# Altium project SmartIMU.PrjPCB
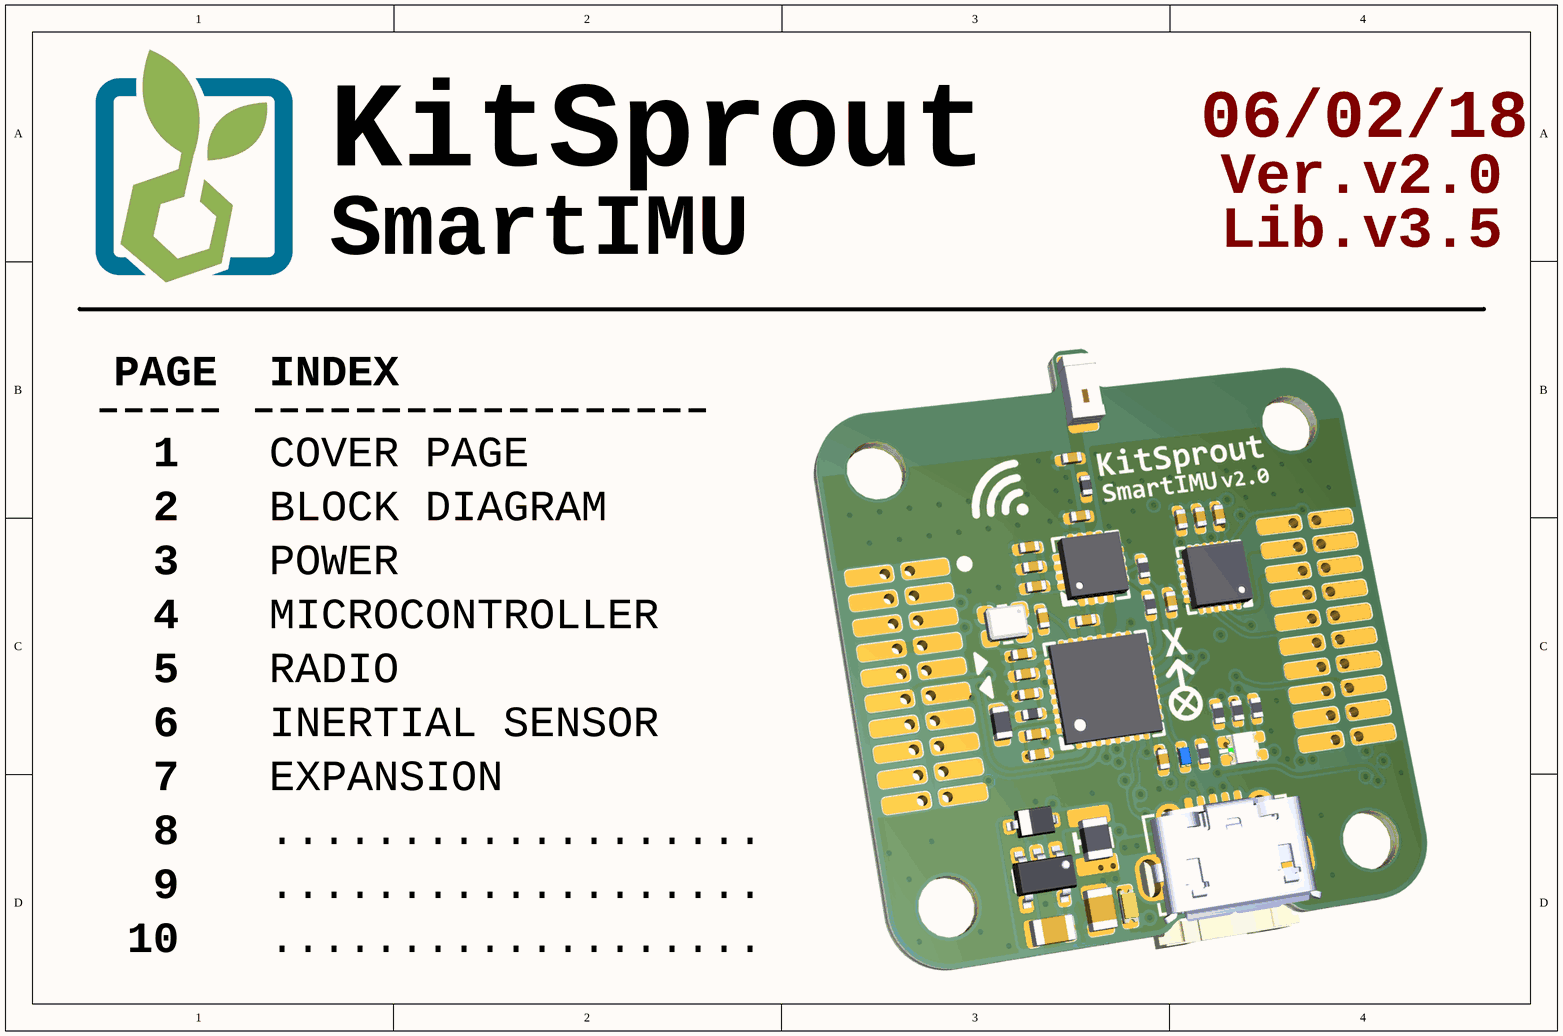
[diagram p0: [01] COVER PAGE.SchDoc]
7 sheets, 66 parts. Net scope: flat (ports and power ports of the same name join across sheets).
Board file: SmartIMU.PcbDoc
Sheets:
  [01] COVER PAGE.SchDoc
  [02] BLOCK DIAGRAM.SchDoc
    SENSOR = [06] INERTIAL SENSOR.SchDoc
    STM32 = [04] MICROCONTROLLER.SchDoc
    NRF52 = [05] RADIO.SchDoc
    LDO = [03] POWER.SchDoc
    EXPANSION = [07] EXPANSION.SchDoc

## Sheet [01] COVER PAGE.SchDoc: SmartIMU
size A4; Author: Hom; CompanyName: KitSprout; DrawnBy: Hom; Engineer: Hom; Organization: KitSprout; Revision: A; SheetNumber: 1; SheetTotal: 7; Version: v2.0; LibVersion: v3.5

### Notes on the sheet
- 06/02/18
- Ver.
- Lib.
- PAGE
- INDEX
- 1
- COVER PAGE
- 2
- 3
- BLOCK DIAGRAM
- POWER
- 4
- MICROCONTROLLER
- 5
- RADIO
- 6
- INERTIAL SENSOR
- 7
- 8
- EXPANSION
- ...................
- 9
- 10

## Sheet [02] BLOCK DIAGRAM.SchDoc: Template
size A4; Author: Hom; CompanyName: KitSprout; DrawnBy: Hom; Engineer: Hom; Organization: KitSprout; Revision: A; SheetNumber: 2; SheetTotal: 7; Version: 0.0; LibVersion: 0.0
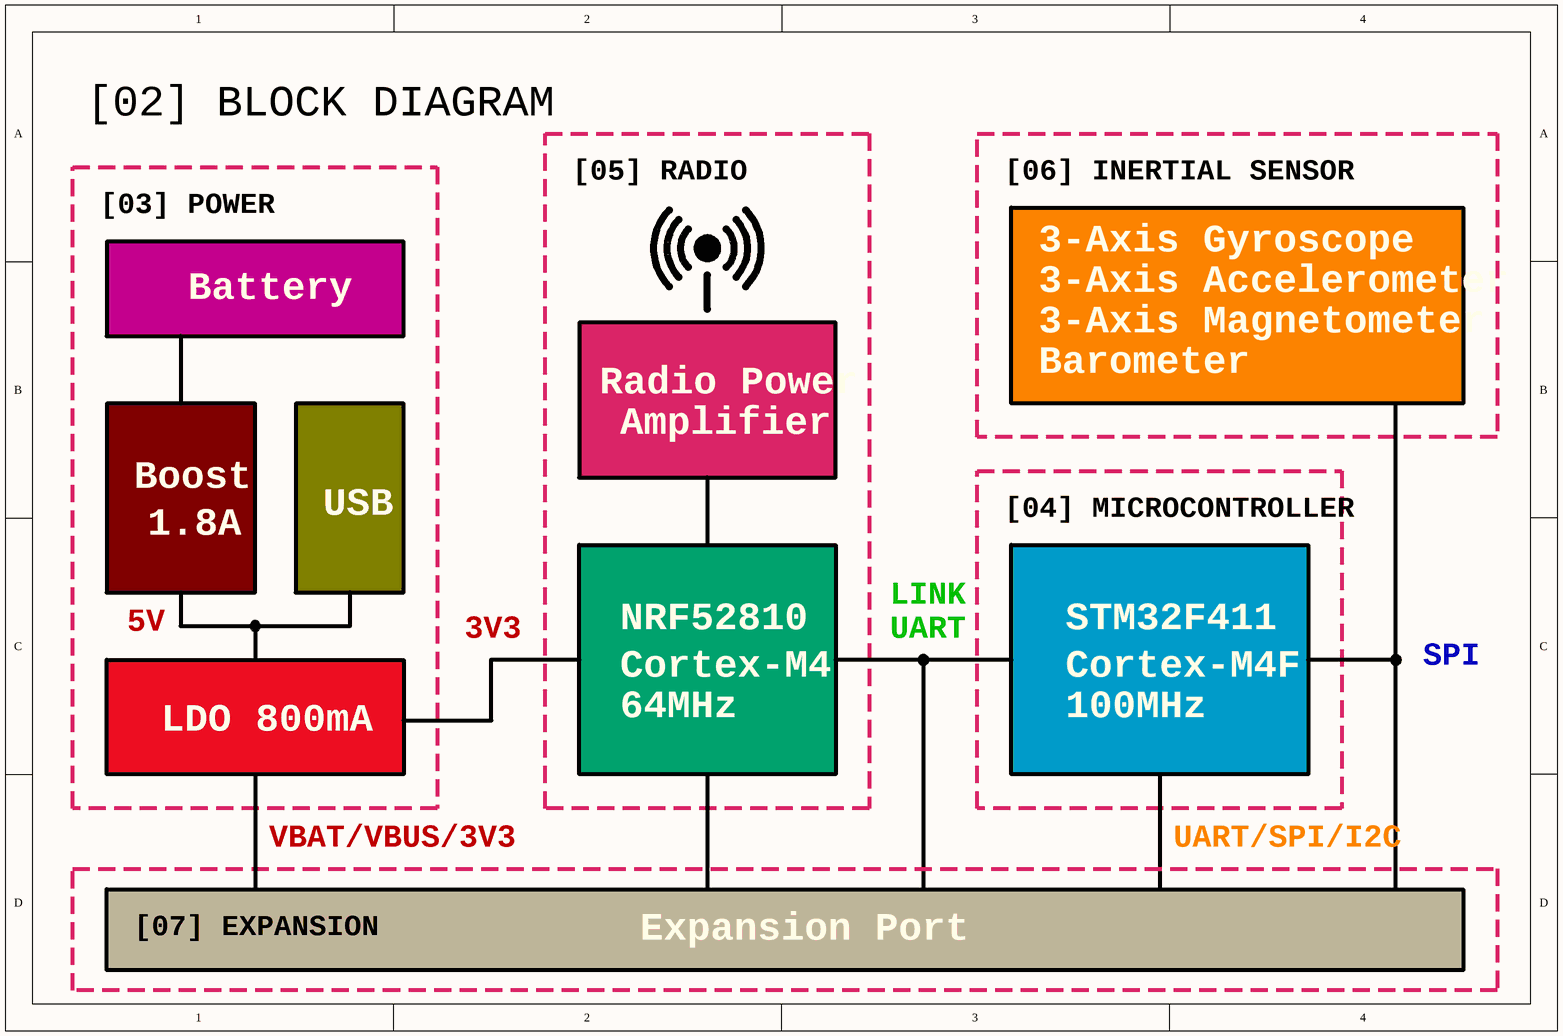
[diagram p1: [02] BLOCK DIAGRAM.SchDoc]

### Sub-sheets
EXPANSION = [07] EXPANSION.SchDoc: no entries
LDO = [03] POWER.SchDoc: no entries
NRF52 = [05] RADIO.SchDoc: no entries
SENSOR = [06] INERTIAL SENSOR.SchDoc: no entries
STM32 = [04] MICROCONTROLLER.SchDoc: no entries

### Notes on the sheet
- [02] BLOCK DIAGRAM
- [03] POWER
- [05] RADIO
- [06] INERTIAL SENSOR
- Battery
- 3-Axis Gyroscope
- 3-Axis Accelerometer
- Barometer
- 3-Axis Magnetometer
- Radio Power
- Amplifier
- Boost
- USB
- [04] MICROCONTROLLER
- 1.8A
- 5V
- 3V3
- NRF52810
- UART
- LINK
- STM32F411
- Cortex-M4
- Cortex-M4F
- SPI
- LDO
- 800mA
- 64MHz
- 100MHz
- VBAT/VBUS/3V3
- UART/SPI/I2C
- [07] EXPANSION
- Expansion Port

## Sheet [06] INERTIAL SENSOR.SchDoc: Template
size A4; Author: Hom; CompanyName: KitSprout; DrawnBy: Hom; Engineer: Hom; Organization: KitSprout; Revision: A; SheetNumber: 6; SheetTotal: 7; Version: 0.0; LibVersion: 0.0
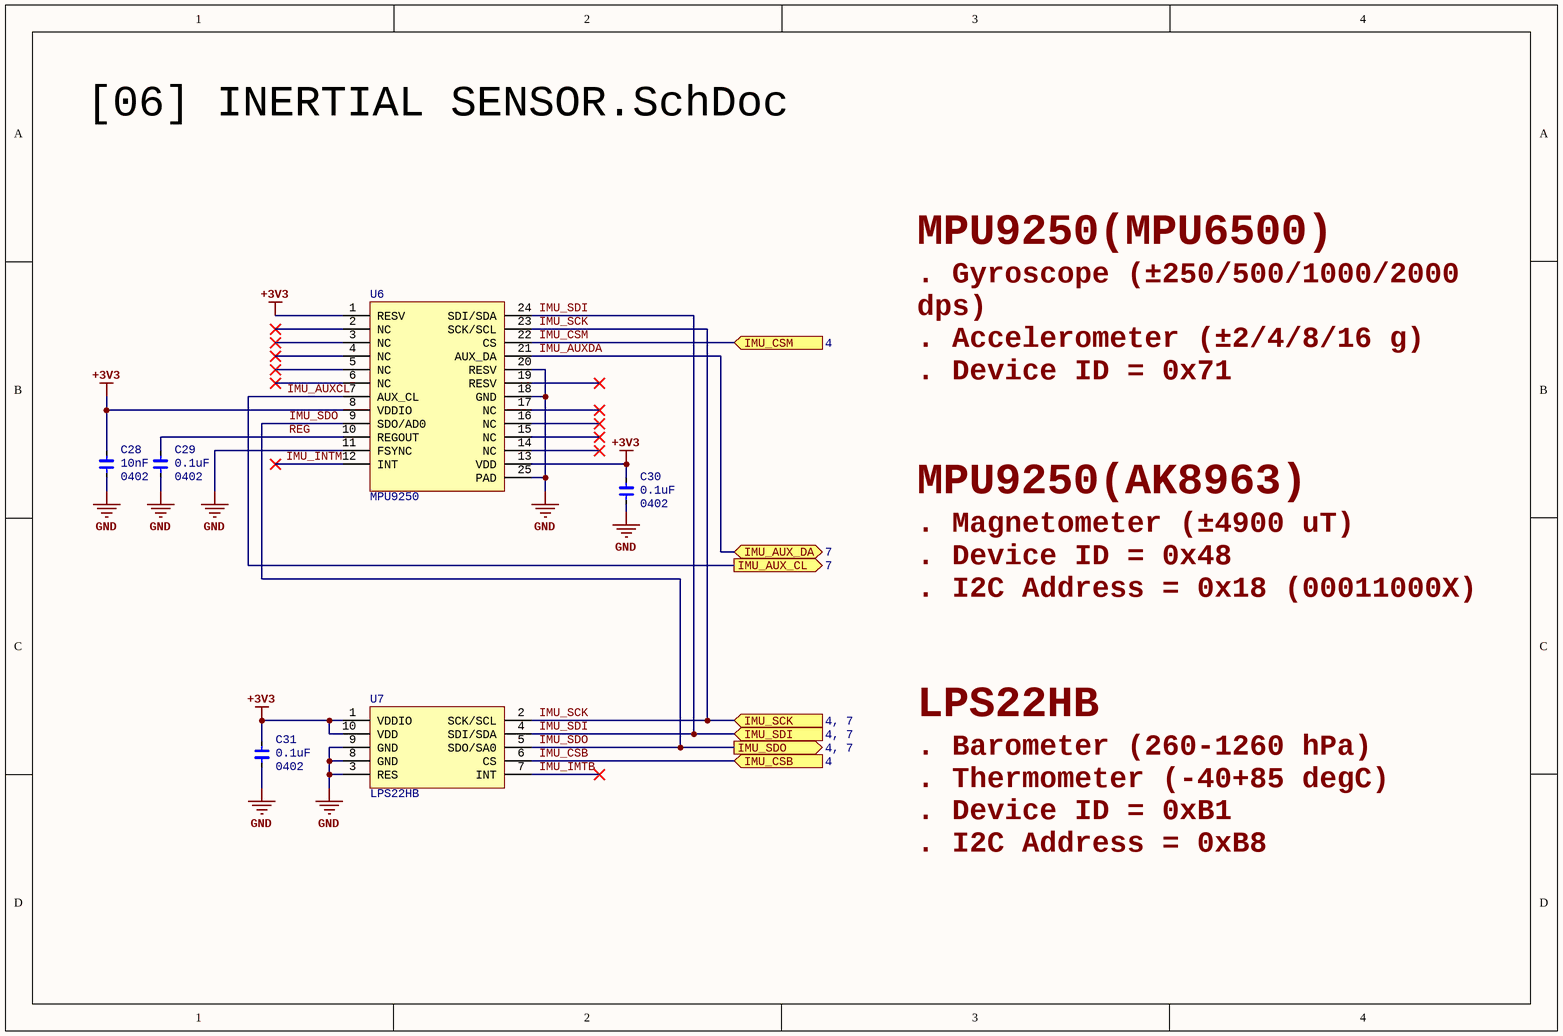
[diagram p2: [06] INERTIAL SENSOR.SchDoc]

### Parts
C28  value 10nF  Type: 0402  [CAP_0402]  (hidden comment: C0402)
C29  value 0.1uF  Type: 0402  [CAP_0402]  (hidden comment: C0402)
C30  value 0.1uF  Type: 0402  [CAP_0402]  (hidden comment: C0402)
C31  value 0.1uF  Type: 0402  [CAP_0402]  (hidden comment: C0402)
U6  MPU9250  [QFN_P0.4_24]
U7  LPS22HB  [HCLGA-2x2_10]

### Ports
IMU_AUX_CL (out, see 7), IMU_AUX_DA (bidir, see 7), IMU_CSB (in, see 4), IMU_CSM (in, see 4), IMU_SCK (in, see 4, 7), IMU_SDI (in, see 4, 7), IMU_SDO (out, see 4, 7)

### Nets
+3V3: C28.2 C30.2 C31.2 U6.1(RESV) U6.8(VDDIO) U6.13(VDD) U7.1(VDDIO) U7.10(VDD)
GND: C28.1 C29.1 C30.1 C31.1 U6.11(FSYNC) U6.18(GND) U6.20(RESV) U6.25(PAD) U7.3(RES) U7.8(GND) U7.9(GND)
IMU_AUXCL: U6.7(AUX_CL) ; port IMU_AUX_CL
IMU_AUXDA: U6.21(AUX_DA) ; port IMU_AUX_DA
IMU_CSB: U7.6(CS) ; port IMU_CSB
IMU_CSM: U6.22(CS) ; port IMU_CSM
IMU_IMTB: U7.7(INT)
IMU_INTM: U6.12(INT)
IMU_SCK: U6.23(SCK/SCL) U7.2(SCK/SCL) ; port IMU_SCK
IMU_SDI: U6.24(SDI/SDA) U7.4(SDI/SDA) ; port IMU_SDI
IMU_SDO: U6.9(SDO/AD0) U7.5(SDO/SA0) ; port IMU_SDO
REG: C29.2 U6.10(REGOUT)

Not connected (* = marked no-connect by the designer): U6 2(NC)* 3(NC)* 4(NC)* 5(NC)* 6(NC)* 14(NC)* 15(NC)* 16(NC)* 17(NC)* 19(RESV)*

### Notes on the sheet
- MPU9250(MPU6500)
- . Gyroscope (±250/500/1000/2000 dps)
  . Accelerometer (±2/4/8/16 g)
  . Device ID = 0x71
  . I2C Address = 0xD0 (1101000X)
- MPU9250(AK8963)
- . Magnetometer (±4900 uT)
  . Device ID = 0x48
  . I2C Address = 0x18 (00011000X)
- LPS22HB
- . Barometer (260-1260 hPa)
  . Thermometer (-40+85 degC)
  . Device ID = 0xB1
  . I2C Address = 0xB8

### Library data of the parts
C28-C31 = Cap_0402: Capacitor; Specification: X7R 50V; Manufacturer: *
U6 = MPU925x: Sensor Motion; Type: QFN24 P0.4
U7 = LPS22HB: Sensor Pressure; Type: LGA10 P0.5

## Sheet [04] MICROCONTROLLER.SchDoc: Template
size A4; Author: Hom; CompanyName: KitSprout; DrawnBy: Hom; Engineer: Hom; Organization: KitSprout; Revision: A; SheetNumber: 4; SheetTotal: 7; Version: 0.0; LibVersion: 0.0
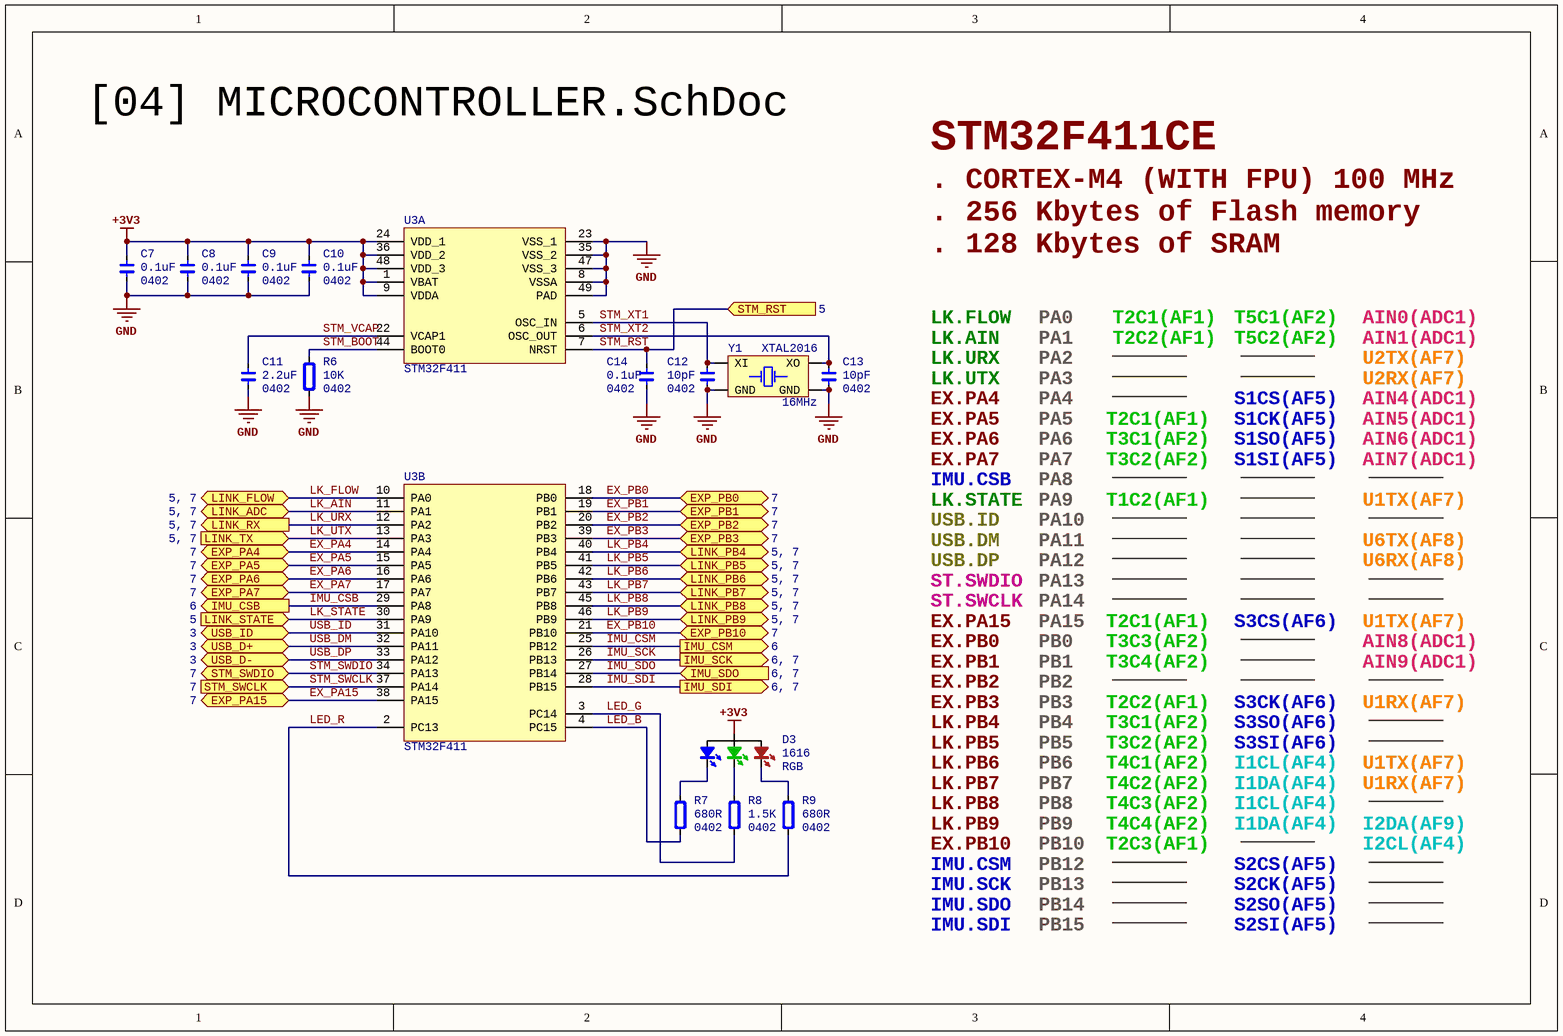
[diagram p3: [04] MICROCONTROLLER.SchDoc]

### Parts
C7  value 0.1uF  Type: 0402  [CAP_0402]  (hidden comment: C0402)
C8  value 0.1uF  Type: 0402  [CAP_0402]  (hidden comment: C0402)
C9  value 0.1uF  Type: 0402  [CAP_0402]  (hidden comment: C0402)
C10  value 0.1uF  Type: 0402  [CAP_0402]  (hidden comment: C0402)
C11  value 2.2uF  Type: 0402  [CAP_0402]  (hidden comment: C0402)
C12  value 10pF  Type: 0402  [CAP_0402]  (hidden comment: C0402)
C13  value 10pF  Type: 0402  [CAP_0402]  (hidden comment: C0402)
C14  value 0.1uF  Type: 0402  [CAP_0402]  (hidden comment: C0402)
D3  Type: 1616  [LED_1616_RGB]  (hidden comment: RGB)
R6  value 10K  Type: 0402  [RES_0402]  (hidden comment: R0402)
R7  value 680R  Type: 0402  [RES_0402]  (hidden comment: R0402)
R8  value 1.5K  Type: 0402  [RES_0402]  (hidden comment: R0402)
R9  value 680R  Type: 0402  [RES_0402]  (hidden comment: R0402)
U3  STM32F411  [QFN_P0.5_48]  (parts A,B of 2)
Y1  value 16MHz  [XT_2016_4]  (hidden comment: XTAL2016)

### Ports
EXP_PA4 (bidir, see 7), EXP_PA5 (bidir, see 7), EXP_PA6 (bidir, see 7), EXP_PA7 (bidir, see 7), EXP_PA15 (bidir, see 7), EXP_PB0 (bidir, see 7), EXP_PB1 (bidir, see 7), EXP_PB2 (bidir, see 7), EXP_PB3 (bidir, see 7), EXP_PB10 (bidir, see 7), IMU_CSB (out, see 6), IMU_CSM (out, see 6), IMU_SCK (out, see 6, 7), IMU_SDI (out, see 6, 7), IMU_SDO (in, see 6, 7), LINK_ADC (bidir, see 5, 7), LINK_FLOW (bidir, see 5, 7), LINK_PB4 (bidir, see 5, 7), LINK_PB5 (bidir, see 5, 7), LINK_PB6 (bidir, see 5, 7), LINK_PB7 (bidir, see 5, 7), LINK_PB8 (bidir, see 5, 7), LINK_PB9 (bidir, see 5, 7), LINK_RX (out, see 5, 7), LINK_STATE (in, see 5), LINK_TX (in, see 5, 7), STM_RST (in, see 5), STM_SWCLK (in, see 7), STM_SWDIO (bidir, see 7), USB_D+ (bidir, see 3), USB_D- (bidir, see 3), USB_ID (bidir, see 3)

### Nets
+3V3: C7.2 C8.2 C9.2 C10.2 D3.4(A) U3.1(VBAT) U3.9(VDDA) U3.24(VDD_1) U3.36(VDD_2) U3.48(VDD_3)
GND: C7.1 C8.1 C9.1 C10.1 C11.1 C12.1 C13.1 C14.1 R6.1 U3.8(VSSA) U3.23(VSS_1) U3.35(VSS_2) U3.47(VSS_3) U3.49(PAD) Y1.2(GND) Y1.4(GND)
EX_PA4: U3.14(PA4) ; port EXP_PA4
EX_PA5: U3.15(PA5) ; port EXP_PA5
EX_PA6: U3.16(PA6) ; port EXP_PA6
EX_PA7: U3.17(PA7) ; port EXP_PA7
EX_PA15: U3.38(PA15) ; port EXP_PA15
EX_PB0: U3.18(PB0) ; port EXP_PB0
EX_PB1: U3.19(PB1) ; port EXP_PB1
EX_PB2: U3.20(PB2) ; port EXP_PB2
EX_PB3: U3.39(PB3) ; port EXP_PB3
EX_PB10: U3.21(PB10) ; port EXP_PB10
IMU_CSB: U3.29(PA8) ; port IMU_CSB
IMU_CSM: U3.25(PB12) ; port IMU_CSM
IMU_SCK: U3.26(PB13) ; port IMU_SCK
IMU_SDI: U3.28(PB15) ; port IMU_SDI
IMU_SDO: U3.27(PB14) ; port IMU_SDO
LED_B: R7.1 U3.4(PC15)
LED_G: R8.1 U3.3(PC14)
LED_R: R9.1 U3.2(PC13)
LK_AIN: U3.11(PA1) ; port LINK_ADC
LK_FLOW: U3.10(PA0) ; port LINK_FLOW
LK_PB4: U3.40(PB4) ; port LINK_PB4
LK_PB5: U3.41(PB5) ; port LINK_PB5
LK_PB6: U3.42(PB6) ; port LINK_PB6
LK_PB7: U3.43(PB7) ; port LINK_PB7
LK_PB8: U3.45(PB8) ; port LINK_PB8
LK_PB9: U3.46(PB9) ; port LINK_PB9
LK_STATE: U3.30(PA9) ; port LINK_STATE
LK_URX: U3.12(PA2) ; port LINK_RX
LK_UTX: U3.13(PA3) ; port LINK_TX
STM_BOOT: R6.2 U3.44(BOOT0)
STM_RST: C14.2 U3.7(NRST) ; port STM_RST
STM_SWCLK: U3.37(PA14) ; port STM_SWCLK
STM_SWDIO: U3.34(PA13) ; port STM_SWDIO
STM_VCAP: C11.2 U3.22(VCAP1)
STM_XT1: C12.2 U3.5(OSC_IN) Y1.1(XI)
STM_XT2: C13.2 U3.6(OSC_OUT) Y1.3(XO)
USB_DM: U3.32(PA11) ; port USB_D+
USB_DP: U3.33(PA12) ; port USB_D-
USB_ID: U3.31(PA10) ; port USB_ID
NetD3_1: D3.1(R) R9.2
NetD3_2: D3.2(G) R8.2
NetD3_3: D3.3(B) R7.2

### Notes on the sheet
- STM32F411CE
- . CORTEX-M4 (WITH FPU) 100 MHz
  . 256 Kbytes of Flash memory
  . 128 Kbytes of SRAM
- LK.FLOW
- LK.AIN
- LK.URX
- LK.UTX
- PA0
- PA1
- PA2
- PA3
- T2C1(AF1)
- T2C2(AF1)
- T5C1(AF2)
- T5C2(AF2)
- AIN0(ADC1)
- AIN1(ADC1)
- U2TX(AF7)
- U2RX(AF7)
- EX.PA4
- EX.PA5
- EX.PA6
- PA4
- PA5
- PA6
- T3C1(AF2)
- S1CS(AF5)
- S1CK(AF5)
- S1SO(AF5)
- AIN4(ADC1)
- AIN5(ADC1)
- AIN6(ADC1)
- EX.PA7
- IMU.CSB
- LK.STATE
- PA7
- PA8
- PA9
- T3C2(AF2)
- T1C2(AF1)
- S1SI(AF5)
- AIN7(ADC1)
- U1TX(AF7)
- USB.ID
- USB.DM
- USB.DP
- PA10
- PA11
- PA12
- U6TX(AF8)
- U6RX(AF8)
- EX.PA15
- EX.PB0
- ST.SWDIO
- ST.SWCLK
- PA15
- PB0
- PA13
- PA14
- T3C3(AF2)
- S3CS(AF6)
- AIN8(ADC1)
- EX.PB1
- EX.PB3
- EX.PB2
- PB1
- PB3
- PB2
- T3C4(AF2)
- S3CK(AF6)
- AIN9(ADC1)
- U1RX(AF7)
- LK.PB4
- LK.PB5
- LK.PB6
- LK.PB7
- PB4
- PB5
- PB6
- PB7
- T4C1(AF2)
- T4C2(AF2)
- I1CL(AF4)
- I1DA(AF4)
- S3SO(AF6)
- S3SI(AF6)
- LK.PB8
- LK.PB9
- EX.PB10
- PB8
- PB9
- PB10
- T4C3(AF2)
- T4C4(AF2)
- T2C3(AF1)
- I2CL(AF4)
- I2DA(AF9)
- IMU.CSM
- IMU.SCK
- IMU.SDO
- PB12
- PB13
- PB14
- S2CS(AF5)
- S2CK(AF5)
- S2SO(AF5)
- IMU.SDI
- PB15
- S2SI(AF5)

### Library data of the parts
C7-C14 = Cap_0402: Capacitor; Specification: X7R 50V; Manufacturer: *
D3 = LED_1616_RGB: LED; Value: RGB
R6-R9 = Res_0402: Resistor; Specification: ±5%; Manufacturer: *
U3 = STM32F4x1C: MCU; Value: 100MHz; Type: QFN48 P0.5
Y1 = XTAL_2016_4P: Crystal Oscillator; Type: XTAL2016

## Sheet [05] RADIO.SchDoc: Template
size A4; Author: Hom; CompanyName: KitSprout; DrawnBy: Hom; Engineer: Hom; Organization: KitSprout; Revision: A; SheetNumber: 5; SheetTotal: 7; Version: 0.0; LibVersion: 0.0
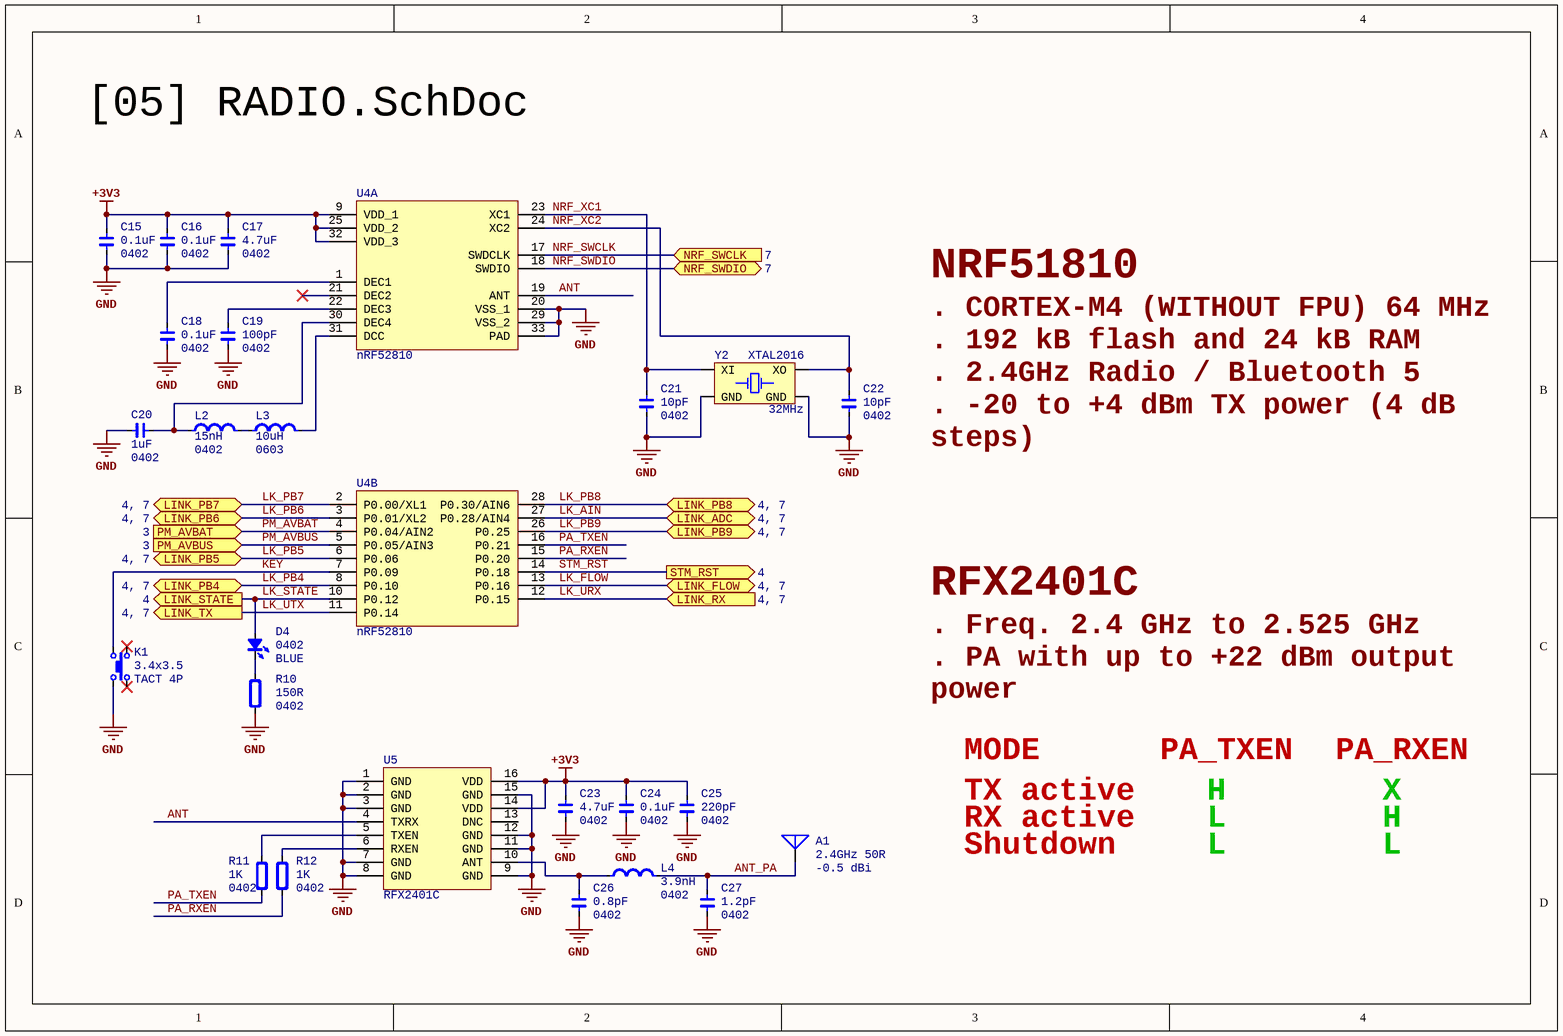
[diagram p4: [05] RADIO.SchDoc]

### Parts
A1  2.4GHz 50R  value -0.5 dBi  [ANT_2.4G_3.2x1.6]
C15  value 0.1uF  Type: 0402  [CAP_0402]  (hidden comment: C0402)
C16  value 0.1uF  Type: 0402  [CAP_0402]  (hidden comment: C0402)
C17  value 4.7uF  Type: 0402  [CAP_0402]  (hidden comment: C0402)
C18  value 0.1uF  Type: 0402  [CAP_0402]  (hidden comment: C0402)
C19  value 100pF  Type: 0402  [CAP_0402]  (hidden comment: C0402)
C20  value 1uF  Type: 0402  [CAP_0402]  (hidden comment: C0402)
C21  value 10pF  Type: 0402  [CAP_0402]  (hidden comment: C0402)
C22  value 10pF  Type: 0402  [CAP_0402]  (hidden comment: C0402)
C23  value 4.7uF  Type: 0402  [CAP_0402]  (hidden comment: C0402)
C24  value 0.1uF  Type: 0402  [CAP_0402]  (hidden comment: C0402)
C25  value 220pF  Type: 0402  [CAP_0402]  (hidden comment: C0402)
C26  value 0.8pF  Type: 0402  [CAP_0402]  (hidden comment: C0402)
C27  value 1.2pF  Type: 0402  [CAP_0402]  (hidden comment: C0402)
D4  Type: 0402  [LED_0402_BLUE]  (hidden comment: BLUE)
K1  value 3.4x3.5  [ButtonTACT_3.4*3.5_90]  (hidden comment: TACT 4P)
L2  value 15nH  Type: 0402  [IND_0402]  (hidden comment: H0402)
L3  value 10uH  Type: 0603  [IND_0603]  (hidden comment: H0603)
L4  value 3.9nH  Type: 0402  [IND_0402]  (hidden comment: H0402)
R10  value 150R  Type: 0402  [RES_0402]  (hidden comment: R0402)
R11  value 1K  Type: 0402  [RES_0402]  (hidden comment: R0402)
R12  value 1K  Type: 0402  [RES_0402]  (hidden comment: R0402)
U4  nRF52810  [QFN_P0.5_32]  (parts A,B of 2)
U5  RFX2401C  [QFN_P0.5_16]
Y2  value 32MHz  [XT_2016_4]  (hidden comment: XTAL2016)

### Ports
LINK_ADC (bidir, see 4, 7), LINK_FLOW (bidir, see 4, 7), LINK_PB4 (bidir, see 4, 7), LINK_PB5 (bidir, see 4, 7), LINK_PB6 (bidir, see 4, 7), LINK_PB7 (bidir, see 4, 7), LINK_PB8 (bidir, see 4, 7), LINK_PB9 (bidir, see 4, 7), LINK_RX (in, see 4, 7), LINK_STATE (out, see 4), LINK_TX (out, see 4, 7), NRF_SWCLK (in, see 7), NRF_SWDIO (bidir, see 7), PM_AVBAT (in, see 3), PM_AVBUS (in, see 3), STM_RST (out, see 4)

### Nets
+3V3: C15.2 C16.2 C17.2 C23.2 C24.2 C25.2 U4.9(VDD_1) U4.25(VDD_2) U4.32(VDD_3) U5.14(VDD) U5.16(VDD)
GND: C15.1 C16.1 C17.1 C18.1 C19.1 C20.2 C21.1 C22.1 C23.1 C24.1 C25.1 C26.1 C27.1 K1.1 R10.1 U4.20(VSS_1) U4.29(VSS_2) U4.33(PAD) U5.1(GND) U5.2(GND) U5.3(GND) U5.7(GND) U5.8(GND) U5.9(GND) U5.11(GND) U5.12(GND) U5.15(GND) Y2.2(GND) Y2.4(GND)
ANT: U4.19(ANT) U5.4(TXRX)
ANT_PA: A1.1(A) C27.2 L4.2
KEY: K1.2 U4.7(P0.09)
LK_AIN: U4.27(P0.28/AIN4) ; port LINK_ADC
LK_FLOW: U4.13(P0.16) ; port LINK_FLOW
LK_PB4: U4.8(P0.10) ; port LINK_PB4
LK_PB5: U4.6(P0.06) ; port LINK_PB5
LK_PB6: U4.3(P0.01/XL2) ; port LINK_PB6
LK_PB7: U4.2(P0.00/XL1) ; port LINK_PB7
LK_PB8: U4.28(P0.30/AIN6) ; port LINK_PB8
LK_PB9: U4.26(P0.25) ; port LINK_PB9
LK_STATE: D4.1(A) U4.10(P0.12) ; port LINK_STATE
LK_URX: U4.12(P0.15) ; port LINK_RX
LK_UTX: U4.11(P0.14) ; port LINK_TX
NRF_SWCLK: U4.17(SWDCLK) ; port NRF_SWCLK
NRF_SWDIO: U4.18(SWDIO) ; port NRF_SWDIO
NRF_XC1: C21.2 U4.23(XC1) Y2.1(XI)
NRF_XC2: C22.2 U4.24(XC2) Y2.3(XO)
PA_RXEN: R12.1 U4.15(P0.20)
PA_TXEN: R11.1 U4.16(P0.21)
PM_AVBAT: U4.4(P0.04/AIN2) ; port PM_AVBAT
PM_AVBUS: U4.5(P0.05/AIN3) ; port PM_AVBUS
STM_RST: U4.14(P0.18) ; port STM_RST
NetC18_2: C18.2 U4.1(DEC1)
NetC19_2: C19.2 U4.22(DEC3)
NetC20_1: C20.1 L2.1 U4.30(DEC4)
NetC26_2: C26.2 L4.1 U5.10(ANT)
NetD4_2: D4.2(K) R10.2
NetL2_2: L2.2 L3.1
NetL3_2: L3.2 U4.31(DCC)
NetR11_2: R11.2 U5.5(TXEN)
NetR12_2: R12.2 U5.6(RXEN)

Not connected (* = marked no-connect by the designer): K1 3* 4*; U4 21(DEC2)*; U5 13(DNC)

### Notes on the sheet
- NRF51810
- . CORTEX-M4 (WITHOUT FPU) 64 MHz
  . 192 kB flash and 24 kB RAM
  . 2.4GHz Radio / Bluetooth 5
  . -20 to +4 dBm TX power (4 dB steps)
  . -96 dBm sensitivity
- RFX2401C
- . Freq. 2.4 GHz to 2.525 GHz
  . PA with up to +22 dBm output power
  . LNA with 2.5 dB noise figure
- MODE
- PA_TXEN
- PA_RXEN
- TX active
- RX active
- H
- L
- X
- Shutdown

### Library data of the parts
A1 = Ant_2.4G: Antenna; type: 3.2x1.6
C15-C27 = Cap_0402: Capacitor; Specification: X7R 50V; Manufacturer: *
D4 = LED_0402: LED; Value: BLUE
K1 = ButtonTACT: Button; type: TACT 4P
L2 L4 = Ind_0402: Inductor; Specification: ±5% 100mA; Manufacturer: *
L3 = Ind_0603: Inductor; Specification: ±5% 100mA; Manufacturer: *
R10-R12 = Res_0402: Resistor; Specification: ±5%; Manufacturer: *
U4 = nRF52810: MCU; Value: 64MHz; Type: QFN32 P0.5
U5 = RFX2401C: Radio PA/LNA; Type: QFN16 P0.5
Y2 = XTAL_2016_4P: Crystal Oscillator; Type: XTAL2016

## Sheet [03] POWER.SchDoc: Template
size A4; Author: Hom; CompanyName: KitSprout; DrawnBy: Hom; Engineer: Hom; Organization: KitSprout; Revision: A; SheetNumber: 3; SheetTotal: 7; Version: 0.0; LibVersion: 0.0
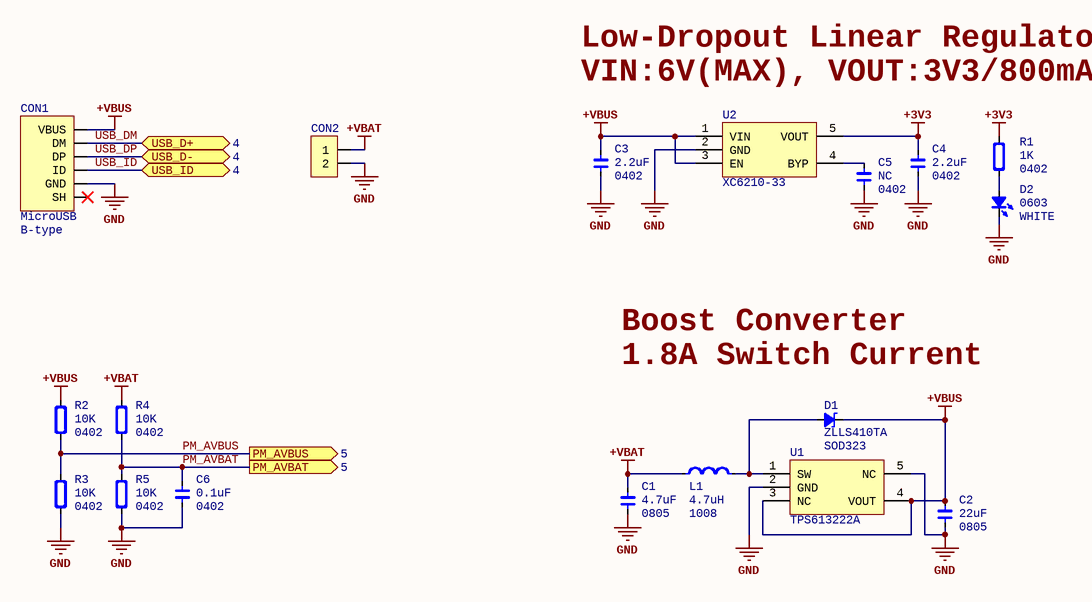
[diagram p5: [03] POWER.SchDoc]

### Parts
C1  value 4.7uF  Type: 0805  [CAP_0805]  (hidden comment: C0805)
C2  value 22uF  Type: 0805  [CAP_0805]  (hidden comment: C0805)
C3  value 2.2uF  Type: 0402  [CAP_0402]  (hidden comment: C0402)
C4  value 2.2uF  Type: 0402  [CAP_0402]  (hidden comment: C0402)
C5  value NC  Type: 0402  [CAP_0402]  (hidden comment: C0402)
C6  value 0.1uF  Type: 0402  [CAP_0402]  (hidden comment: C0402)
CON1  MicroUSB  Type: B-type  [USB_Micro-AB]
CON2  MX1.25_2P  [MX1.25_S90_2P]  (value not drawn)
D1  Type: SOD323  [SOD-323]  (hidden comment: ZLLS410TA)
D2  Type: 0603  [LED_0603_YELLOW]  (hidden comment: WHITE)
L1  value 4.7uH  Type: 1008  [IND_1008]  (hidden comment: H1008)
R1  value 1K  Type: 0402  [RES_0402]  (hidden comment: R0402)
R2  value 10K  Type: 0402  [RES_0402]  (hidden comment: R0402)
R3  value 10K  Type: 0402  [RES_0402]  (hidden comment: R0402)
R4  value 10K  Type: 0402  [RES_0402]  (hidden comment: R0402)
R5  value 10K  Type: 0402  [RES_0402]  (hidden comment: R0402)
U1  TPS613222A  [SOT23-5]
U2  XC6210-33  [SOT23-5]

### Ports
PM_AVBAT (out, see 5), PM_AVBUS (out, see 5), USB_D+ (bidir, see 4), USB_D- (bidir, see 4), USB_ID (bidir, see 4)

### Nets
+3V3: C4.2 R1.2 U2.5(VOUT)
+VBAT: C1.2 CON2.1 L1.1 R4.2
+VBUS: C2.2 C3.2 CON1.1(VBUS) D1.2(K) R2.2 U1.3(NC) U1.4(VOUT) U2.1(VIN) U2.3(EN)
GND: C1.1 C2.1 C3.1 C4.1 C5.1 C6.1 CON1.5(GND) CON2.2 D2.2(K) R3.1 R5.1 U1.2(GND) U1.5(NC) U2.2(GND)
PM_AVBAT: C6.2 R4.1 R5.2 ; port PM_AVBAT
PM_AVBUS: R2.1 R3.2 ; port PM_AVBUS
USB_DM: CON1.2(DM) ; port USB_D+
USB_DP: CON1.3(DP) ; port USB_D-
USB_ID: CON1.4(ID) ; port USB_ID
NetC5_2: C5.2 U2.4(BYP)
NetD1_1: D1.1(A) L1.2 U1.1(SW)
NetD2_1: D2.1(A) R1.1

Not connected (* = marked no-connect by the designer): CON1 0(SH)*

### Notes on the sheet
- Low-Dropout Linear Regulator
- VIN:6V(MAX), VOUT:3V3/800mA
- Boost Converter
- (near D1) 1.8A Switch Current

### Library data of the parts
C1 C2 = Cap_0805: Capacitor; Specification: X7R 50V; Manufacturer: *
C3-C6 = Cap_0402: Capacitor; Specification: X7R 50V; Manufacturer: *
CON1 = USB_Micro: USB
CON2 = MX1.25_2P: MX
D1 = SchottkyDiode_SOD323: Schottky Diode; Value: ZLLS410TA
D2 = LED_0603: LED; Value: WHITE
L1 = Ind_1008: Inductor; Specification: ±5% 100mA; Manufacturer: *
R1-R5 = Res_0402: Resistor; Specification: ±5%; Manufacturer: *
U1 = TPS61322xx: Power; Value: 5V; Type: SOT23-5
U2 = RT9193: Power; Value: 3V3; Type: SOT23-5

## Sheet [07] EXPANSION.SchDoc: Template
size A4; Author: Hom; CompanyName: KitSprout; DrawnBy: Hom; Engineer: Hom; Organization: KitSprout; Revision: A; SheetNumber: 7; SheetTotal: 7; Version: 0.0; LibVersion: 0.0
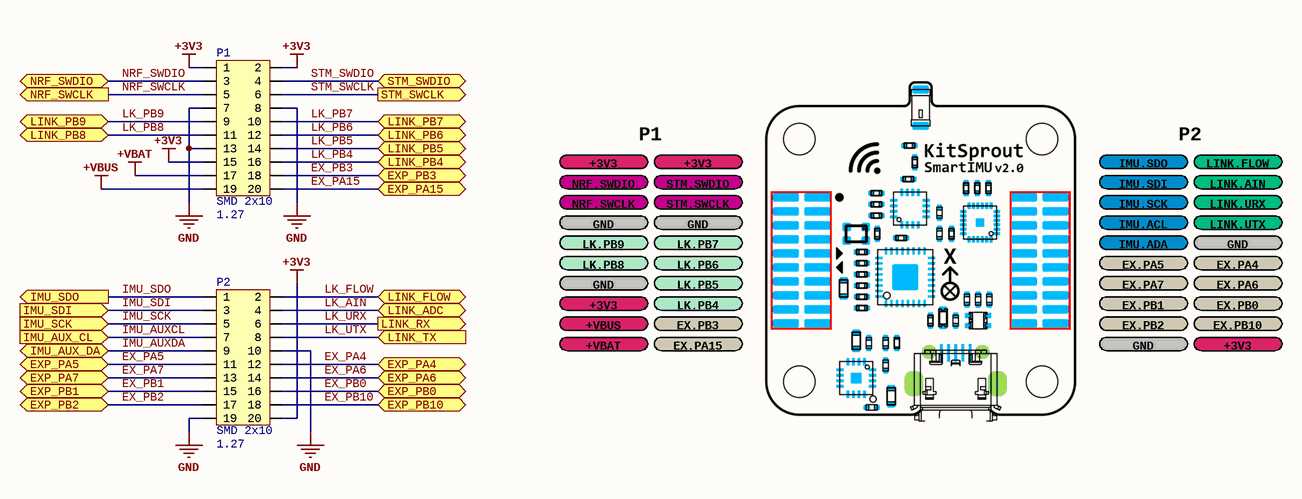
[diagram p6: [07] EXPANSION.SchDoc]

### Parts
P1  Type: SMD 2x10  [HDR2X10_1.27_180TBH]  (hidden comment: 1.27)
P2  Type: SMD 2x10  [HDR2X10_1.27_180TBH]  (hidden comment: 1.27)

### Ports
EXP_PA4 (bidir), EXP_PA5 (bidir), EXP_PA6 (bidir), EXP_PA7 (bidir), EXP_PA15 (bidir), EXP_PB0 (bidir), EXP_PB1 (bidir), EXP_PB2 (bidir), EXP_PB3 (bidir), EXP_PB10 (bidir), IMU_AUX_CL (in), IMU_AUX_DA (bidir), IMU_SCK (in), IMU_SDI (in), IMU_SDO (out), LINK_ADC (bidir), LINK_FLOW (bidir), LINK_PB4 (bidir), LINK_PB5 (bidir), LINK_PB6 (bidir), LINK_PB7 (bidir), LINK_PB8 (bidir), LINK_PB9 (bidir), LINK_RX (out), LINK_TX (in), NRF_SWCLK (out), NRF_SWDIO (bidir), STM_SWCLK (out), STM_SWDIO (bidir)

### Nets
+3V3: P1.1 P1.2 P1.15 P2.20
+VBAT: P1.17
+VBUS: P1.19
GND: P1.7 P1.8 P1.13 P2.10 P2.19
EX_PA4: P2.12 ; port EXP_PA4
EX_PA5: P2.11 ; port EXP_PA5
EX_PA6: P2.14 ; port EXP_PA6
EX_PA7: P2.13 ; port EXP_PA7
EX_PA15: P1.20 ; port EXP_PA15
EX_PB0: P2.16 ; port EXP_PB0
EX_PB1: P2.15 ; port EXP_PB1
EX_PB2: P2.17 ; port EXP_PB2
EX_PB3: P1.18 ; port EXP_PB3
EX_PB10: P2.18 ; port EXP_PB10
IMU_AUXCL: P2.7 ; port IMU_AUX_CL
IMU_AUXDA: P2.9 ; port IMU_AUX_DA
IMU_SCK: P2.5 ; port IMU_SCK
IMU_SDI: P2.3 ; port IMU_SDI
IMU_SDO: P2.1 ; port IMU_SDO
LK_AIN: P2.4 ; port LINK_ADC
LK_FLOW: P2.2 ; port LINK_FLOW
LK_PB4: P1.16 ; port LINK_PB4
LK_PB5: P1.14 ; port LINK_PB5
LK_PB6: P1.12 ; port LINK_PB6
LK_PB7: P1.10 ; port LINK_PB7
LK_PB8: P1.11 ; port LINK_PB8
LK_PB9: P1.9 ; port LINK_PB9
LK_URX: P2.6 ; port LINK_RX
LK_UTX: P2.8 ; port LINK_TX
NRF_SWCLK: P1.5 ; port NRF_SWCLK
NRF_SWDIO: P1.3 ; port NRF_SWDIO
STM_SWCLK: P1.6 ; port STM_SWCLK
STM_SWDIO: P1.4 ; port STM_SWDIO

### Notes on the sheet
- +3V3
- P1
- IMU.SDO
- P2
- LINK.FLOW
- NRF.SWDIO
- NRF.SWCLK
- GND
- STM.SWDIO
- STM.SWCLK
- IMU.SDI
- IMU.SCK
- IMU.ACL
- LINK.AIN
- LINK.URX
- LINK.UTX
- LK.PB9
- LK.PB8
- LK.PB7
- LK.PB6
- LK.PB5
- IMU.ADA
- EX.PA5
- EX.PA7
- EX.PA4
- EX.PA6
- +VBUS
- +VBAT
- EX.PB3
- EX.PA15
- LK.PB4
- EX.PB1
- EX.PB2
- EX.PB0
- EX.PB10

### Library data of the parts
P1 P2 = HDR2x10_1.27: Header; Value: 1.27

## Nets that join several sheets
+3V3: [06] INERTIAL SENSOR (8 pins), [04] MICROCONTROLLER (10 pins), [05] RADIO (11 pins), [03] POWER (C4.2 R1.2 U2.5), [07] EXPANSION (P1.1 P1.2 P1.15 P2.20)
+VBAT: [03] POWER (C1.2 CON2.1 L1.1 R4.2), [07] EXPANSION (P1.17)
+VBUS: [03] POWER (9 pins), [07] EXPANSION (P1.19)
GND: [06] INERTIAL SENSOR (11 pins), [04] MICROCONTROLLER (16 pins), [05] RADIO (29 pins), [03] POWER (14 pins), [07] EXPANSION (5 pins)
EX_PA4: [04] MICROCONTROLLER (U3.14), [07] EXPANSION (P2.12)
EX_PA5: [04] MICROCONTROLLER (U3.15), [07] EXPANSION (P2.11)
EX_PA6: [04] MICROCONTROLLER (U3.16), [07] EXPANSION (P2.14)
EX_PA7: [04] MICROCONTROLLER (U3.17), [07] EXPANSION (P2.13)
EX_PA15: [04] MICROCONTROLLER (U3.38), [07] EXPANSION (P1.20)
EX_PB0: [04] MICROCONTROLLER (U3.18), [07] EXPANSION (P2.16)
EX_PB1: [04] MICROCONTROLLER (U3.19), [07] EXPANSION (P2.15)
EX_PB2: [04] MICROCONTROLLER (U3.20), [07] EXPANSION (P2.17)
EX_PB3: [04] MICROCONTROLLER (U3.39), [07] EXPANSION (P1.18)
EX_PB10: [04] MICROCONTROLLER (U3.21), [07] EXPANSION (P2.18)
IMU_AUXCL: [06] INERTIAL SENSOR (U6.7), [07] EXPANSION (P2.7)
IMU_AUXDA: [06] INERTIAL SENSOR (U6.21), [07] EXPANSION (P2.9)
IMU_CSB: [06] INERTIAL SENSOR (U7.6), [04] MICROCONTROLLER (U3.29)
IMU_CSM: [06] INERTIAL SENSOR (U6.22), [04] MICROCONTROLLER (U3.25)
IMU_SCK: [06] INERTIAL SENSOR (U6.23 U7.2), [04] MICROCONTROLLER (U3.26), [07] EXPANSION (P2.5)
IMU_SDI: [06] INERTIAL SENSOR (U6.24 U7.4), [04] MICROCONTROLLER (U3.28), [07] EXPANSION (P2.3)
IMU_SDO: [06] INERTIAL SENSOR (U6.9 U7.5), [04] MICROCONTROLLER (U3.27), [07] EXPANSION (P2.1)
LK_AIN: [04] MICROCONTROLLER (U3.11), [05] RADIO (U4.27), [07] EXPANSION (P2.4)
LK_FLOW: [04] MICROCONTROLLER (U3.10), [05] RADIO (U4.13), [07] EXPANSION (P2.2)
LK_PB4: [04] MICROCONTROLLER (U3.40), [05] RADIO (U4.8), [07] EXPANSION (P1.16)
LK_PB5: [04] MICROCONTROLLER (U3.41), [05] RADIO (U4.6), [07] EXPANSION (P1.14)
LK_PB6: [04] MICROCONTROLLER (U3.42), [05] RADIO (U4.3), [07] EXPANSION (P1.12)
LK_PB7: [04] MICROCONTROLLER (U3.43), [05] RADIO (U4.2), [07] EXPANSION (P1.10)
LK_PB8: [04] MICROCONTROLLER (U3.45), [05] RADIO (U4.28), [07] EXPANSION (P1.11)
LK_PB9: [04] MICROCONTROLLER (U3.46), [05] RADIO (U4.26), [07] EXPANSION (P1.9)
LK_STATE: [04] MICROCONTROLLER (U3.30), [05] RADIO (D4.1 U4.10)
LK_URX: [04] MICROCONTROLLER (U3.12), [05] RADIO (U4.12), [07] EXPANSION (P2.6)
LK_UTX: [04] MICROCONTROLLER (U3.13), [05] RADIO (U4.11), [07] EXPANSION (P2.8)
NRF_SWCLK: [05] RADIO (U4.17), [07] EXPANSION (P1.5)
NRF_SWDIO: [05] RADIO (U4.18), [07] EXPANSION (P1.3)
PM_AVBAT: [05] RADIO (U4.4), [03] POWER (C6.2 R4.1 R5.2)
PM_AVBUS: [05] RADIO (U4.5), [03] POWER (R2.1 R3.2)
STM_RST: [04] MICROCONTROLLER (C14.2 U3.7), [05] RADIO (U4.14)
STM_SWCLK: [04] MICROCONTROLLER (U3.37), [07] EXPANSION (P1.6)
STM_SWDIO: [04] MICROCONTROLLER (U3.34), [07] EXPANSION (P1.4)
USB_DM: [04] MICROCONTROLLER (U3.32), [03] POWER (CON1.2)
USB_DP: [04] MICROCONTROLLER (U3.33), [03] POWER (CON1.3)
USB_ID: [04] MICROCONTROLLER (U3.31), [03] POWER (CON1.4)